# Altium project Enigma Rev A.PrjPCB (part 9 of 10)

## Sheet Power V12P0.SchDoc: 12.0 V Regulator
size Tabloid; Date: 8/14/2017; ApprovedBy: NA; CompanyName: Cospan Design LLC; DrawnBy: Dave McCoy; Engineer: Dave McCoy; DocumentNumber: 19; Revision: A; SheetNumber: 19; SheetTotal: 20; Client: Public; Project: Enigma; ProjectPrettyName: Enigma
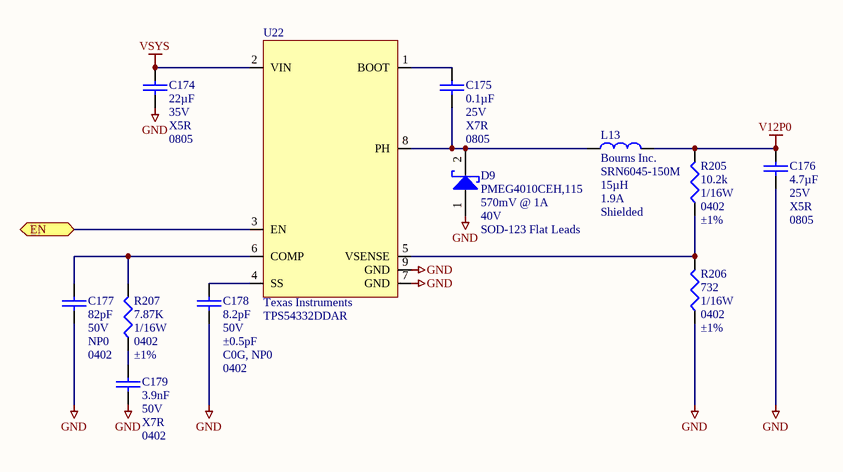
[diagram p17: Power V12P0.SchDoc]

### Parts
C174  Capacitance: 22µF  Voltage - Rated: 35V  Temperature Coefficient: X5R  Package / Case: 0805  [C_ERA-0805]  (hidden comment: C_0805_22µF_35V)
C175  Capacitance: 0.1µF  Voltage - Rated: 25V  Temperature Coefficient: X7R  Package / Case: 0805  [C_ERA-0805]  (hidden comment: 0.1uF)
C176  Voltage - Rated: 25V  Temperature Coefficient: X5R  Package / Case: 0805  [C_ERA-0805]  (hidden comment: 4.7µF)
C177  Voltage - Rated: 50V  Temperature Coefficient: NP0  Package / Case: 0402  [C_ERA-0402]  (hidden comment: 82pF)
C178  Voltage - Rated: 50V  Tolerance: ±0.5pF  Temperature Coefficient: C0G, NP0  Package / Case: 0402  [C_ERA-0402]  (hidden comment: 8.2pF)
C179  Capacitance: 3.9nF  Voltage - Rated: 50V  Temperature Coefficient: X7R  Package / Case: 0402  [C_0402]  (hidden comment: C_0402_3.9nF)
D9  Manufacturer Part Number: PMEG4010CEH,115  Voltage - Forward (Vf) (Max) @ If: 570mV @ 1A  Voltage - DC Reverse (Vr) (Max): 40V  Package / Case: SOD-123 Flat Leads  [D_SOD123F]  (hidden comment: D_SCHOTT_PMEG4010CEH)
L13  Manufacturer: Bourns Inc.  Manufacturer Part Number: SRN6045-150M  Inductance: 15µH  Current Rating: 1.9A  Shielding: Shielded  [SRN6045]  (hidden comment: L_SRN6045-150M)
R205  Resistance In Ohms: 10.2k  Power (Watts): 1/16W  Case: 0402  Tolerance: ±1%  [R_0402]  (hidden comment: R_0402_10.2k)
R206  Resistance In Ohms: 732  Power (Watts): 1/16W  Case: 0402  Tolerance: ±1%  [R_0402]  (hidden comment: R_0402_732)
R207  Resistance In Ohms: 7.87K  Power (Watts): 1/16W  Case: 0402  Tolerance: ±1%  [R_0402]  (hidden comment: R_0402_7.87K)
U22  Manufacturer: Texas Instruments  Manufacturer Part Number: TPS54332DDAR  [DDA0008H]  (hidden comment: U_TPS54332DDAR)

### Ports
EN

### Nets
GND: C174.1 C176.1 C177.1 C178.1 C179.1 D9.1(A) R206.2 U22.7(GND) U22.9(GND)
V12P0: C176.2 L13.1 R205.1
VSYS: C174.2 U22.2(VIN)
INT_REG_EN: U22.3(EN) ; port EN
NetC175_1: C175.1 D9.2(K) L13.2 U22.8(PH)
NetC175_2: C175.2 U22.1(BOOT)
NetC177_2: C177.2 R207.1 U22.6(COMP)
NetC178_2: C178.2 U22.4(SS)
NetC179_2: C179.2 R207.2
NetR205_2: R205.2 R206.1 U22.5(VSENSE)

### Library data of the parts
C174 = C_0805_22µF_35V: CAP CER 22UF 35V X5R 0805; Manufacturer: TDK Corporation; Manufacturer Part Number: C2012X5R1V226M125AC; Tolerance: ±20%; Supplier 1: Digi-Key; RoHS: RoHS Compliant; Category: Capacitors; Stock 1: 3681; Pricing 1: 1=1.14, 10=0.863, 100=0.6176, 500=0.47818, 1000=0.41176 (USD); Packaging: Cut Tape (CT); Mounting Type: Surface Mount, MLCC; Operating Temperature: -55°C ~ 85°C; Applications: General Purpose; Ratings: -; Size / Dimension: 0.079" L x 0.049" W (2.00mm x 1.25mm); Height - Seated (Max): -; Thickness (Max): 0.057" (1.45mm); Lead Spacing: -; Features: Low ESL; Lead Style: -; ComponentLink1URL: https://product.tdk.com/info/en/catalog/datasheets/mlcc_commercial_general_en.pdf; ComponentLink1Description: https://product.tdk.com/info/en/catalog/datasheets/mlcc_commercial_general_en.pdf; Supplier Part Number 1: 445-14428-1-ND; Part Status: Active; Failure Rate: -
C175 = C_0805_0.1uF_25V: CAP CER 1UF 50V X7R 0805; Manufacturer: AVX Corporation; Manufacturer Part Number: 08053C104KAT2A; Tolerance: ±10%; Supplier 1: Digi-Key; Supplier Part Number 1: 478-3755-1-ND; RoHS: RoHS Compliant; Category: Capacitors; Stock 1: 294368; Pricing: 1=0.22, 10=0.138, 100=0.0495, 250=0.03576, 500=0.0264, 1000=0.01788 (USD); Mounting Type: Surface Mount, MLCC; Operating Temperature: -55°C ~ 125°C; Applications: General Purpose; Ratings: -; Size / Dimension: 0.079" L x 0.049" W (2.01mm x 1.25mm); Height - Seated (Max): -; Thickness (Max): 0.037" (0.94mm); Lead Spacing: -; Features: -; Packaging: Cut Tape (CT); Lead Style: -; ComponentLink1URL: http://www.avx.com/docs/Catalogs/cx7r.pdf; ComponentLink1Description: http://www.avx.com/docs/Catalogs/cx7r.pdf
C176 = C_0805_4.7µF_25V: CAP CER 4.7UF 25V 10% X5R 0805; Manufacturer: Taiyo Yuden; Manufacturer Part Number: TMK212BJ475KG-T; Supplier 1: Digi-Key; RoHS: RoHS Compliant; Category: Capacitors; Stock 1: 38955; Pricing 1: 1=0.24, 10=0.2, 50=0.1126, 100=0.1, 250=0.075, 500=0.06626, 1000=0.05875 (USD); Tolerance: ±10%; Mounting Type: Surface Mount, MLCC; Operating Temperature: -55°C ~ 85°C; Applications: General Purpose; Ratings: -; Size / Dimension: 0.079" L x 0.049" W (2.00mm x 1.25mm); Height - Seated (Max): -; Thickness (Max): 0.053" (1.35mm); Lead Spacing: -; Features: -; Packaging: Cut Tape (CT); Lead Style: -; ComponentLink1URL: http://www.yuden.co.jp/productdata/catalog/en/mlcc01_e.pdf; ComponentLink1Description: http://www.yuden.co.jp/productdata/catalog/en/mlcc01_e.pdf; Supplier Part Number 1: 587-1782-1-ND; Capacitance: 4.7µF
C177 = C_0402_82PF_50V: CAP CER 82PF 50V 5% C0G 0402; Manufacturer: Murata Electronics North America; Manufacturer Part Number: GRM1555C1H820FA01D; Tolerance: ±1%; Description: CAP CER 82PF 50V C0G/NP0 0402; Supplier 1: Digi-Key; Supplier Part Number 1: 490-8228-1-ND; RoHS: RoHS Compliant; Category: Capacitors; Stock 1: 248442; Mounting Type: Surface Mount, MLCC; Operating Temperature: -55°C ~ 125°C; Applications: General Purpose; Ratings: -; Size / Dimension: 0.039" L x 0.020" W (1.00mm x 0.50mm); Lead Spacing: -; Features: -; Packaging: Cut Tape (CT); Lead Style: -; ComponentLink1URL: http://search.murata.co.jp/Ceramy/image/img/A01X/G101/ENG/GRM1555C1H820FA01-01.pdf; ComponentLink1Description: http://search.murata.co.jp/Ceramy/image/img/A01X/G101/ENG/GRM1555C1H820FA01-01.pdf; Capacitance: 82pF; Pricing 1: 1=0.1, 10=0.061, 100=0.0273, 500=0.01948, 1000=0.01531, 2500=0.01392, 5000=0.0128 (USD); Part Status: Active; Height - Seated (Max): -; Thickness (Max): 0.022" (0.55mm)
C178 = C_0402_8.2PF_50V: CAP CER 8.2PF 50V NP0 0402; Manufacturer: Yageo; Manufacturer Part Number: CC0402DRNPO9BN8R2; Description: CAP CER 8.2PF 50V C0G/NPO 0402; Supplier 1: Digi-Key; Supplier Part Number 1: 311-1012-1-ND; RoHS: RoHS Compliant; Category: Capacitors; Stock 1: 98543; Mounting Type: Surface Mount, MLCC; Operating Temperature: -55°C ~ 125°C; Applications: General Purpose; Ratings: -; Size / Dimension: 0.039" L x 0.020" W (1.00mm x 0.50mm); Height - Seated (Max): -; Thickness (Max): 0.022" (0.55mm); Lead Spacing: -; Features: -; Packaging: Cut Tape (CT); Lead Style: -; ComponentLink1URL: http://www.yageo.com/documents/recent/UPY-GP_NP0_16V-to-50V_16.pdf; ComponentLink1Description: http://www.yageo.com/documents/recent/UPY-GP_NP0_16V-to-50V_16.pdf; Capacitance: 8.2pF; Pricing 1: 1=0.1, 10=0.029, 100=0.0128, 500=0.00914, 1000=0.00718, 2500=0.00653, 5000=0.006 (USD); Part Status: Active; Failure Rate: -
C179 = C_0402_3.9nF: CAP CER 3900PF 50V X7R 0402; Manufacturer: Murata Electronics North America; Manufacturer Part Number: GRM155R71H392KA01D; Tolerance: ±10%; Supplier 1: Digi-Key; RoHS: RoHS Compliant; Category: Capacitors; Stock 1: 264193; Pricing 1: 1=0.1, 10=0.026, 100=0.0118, 500=0.00844, 1000=0.00662, 2500=0.00602, 5000=0.00554 (USD); Packaging: Cut Tape (CT); Part Status: Active; Operating Temperature: -55°C ~ 125°C; Features: -; Ratings: -; Applications: General Purpose; Mounting Type: Surface Mount, MLCC; Size / Dimension: 0.039" L x 0.020" W (1.00mm x 0.50mm); Height - Seated (Max): -; Thickness (Max): 0.022" (0.55mm); Lead Spacing: -; Lead Style: -; ComponentLink1URL: http://www.murata.com/~/media/webrenewal/support/library/catalog/products/capacitor/mlcc/c02e.ashx; ComponentLink1Description: http://www.murata.com/~/media/webrenewal/support/library/catalog/products/capacitor/mlcc/c02e.ashx; Supplier Part Number 1: 490-1307-1-ND
D9 = D_SCHOTT_PMEG4010CEH: SCHOTTKY RECT 40V 1A SOD123F; Manufacturer: Vishay Semiconductor Diodes Division; Speed: Fast Recovery =< 500ns, > 200mA (Io); Current - Reverse Leakage @ Vr: 500µA @ 40V; Capacitance @ Vr, F: 38pF @ 10V, 1MHz; Supplier 1: Digi-Key; RoHS: RoHS Compliant; Category: Discrete Semiconductor Products; Stock 1: 11879; Pricing 1: 1=0.46, 10=0.371, 25=0.3396, 100=0.2528, 250=0.22912, 500=0.1896, 1000=0.1422, 2500=0.13035 (USD); Packaging: Cut Tape (CT); Part Status: Active; Diode Type: Schottky; Current - Average Rectified (Io): 1A; Reverse Recovery Time (trr): -; Mounting Type: Surface Mount; Supplier Device Package: SMA; Operating Temperature - Junction: -55°C ~ 150°C; ComponentLink1URL: http://www.vishay.com/docs/94301/vs-mbra140trpbf.pdf; ComponentLink1Description: http://www.vishay.com/docs/94301/vs-mbra140trpbf.pdf; Supplier Part Number 1: VS-MBRA140TRPBFCT-ND
L13 = L_SRN6045-150M: FIXED IND 15UH 1.9A 95.8 MOHM; Vendor: Bourns; Type: DEV; Material - Core: Ferrite; Tolerance: ±20%; Current - Saturation: 2.3A; DC Resistance (DCR): 95.8 mOhm Max; Q @ Freq: 17 @ 2.52MHz; Frequency - Self Resonant: 13MHz; Frequency - Test: 100kHz; Datasheet URL: http://www.bourns.com/data/global/pdfs/SRN6045.pdf; Manufacturer_Part_Number: SRN6045-150M; Manufacturer_Name: Bourns; RefDes: RefDes; Value: Value; Supplier 1: Digi-Key; RoHS: RoHS Compliant; Category: Inductors, Coils, Chokes; Stock 1: 3119; Pricing 1: 1=0.43, 10=0.384, 25=0.36, 50=0.312, 100=0.288, 250=0.2736, 500=0.2496 (USD); Packaging: Cut Tape (CT); Part Status: Active; Ratings: -; Operating Temperature: -40°C ~ 125°C; Mounting Type: Surface Mount; Package / Case: Nonstandard; Size / Dimension: 0.236" L x 0.236" W (6.00mm x 6.00mm); Height - Seated (Max): 0.177" (4.50mm); ComponentLink1URL: http://www.bourns.com/docs/Product-Datasheets/SRN6045.pdf; ComponentLink1Description: http://www.bourns.com/docs/Product-Datasheets/SRN6045.pdf; Supplier Part Number 1: SRN6045-150MCT-ND
R205 = R_0402_10.2k: RES SMD 10.2K OHM 1% 1/16W 0402; Manufacturer: Stackpole Electronics Inc.; Manufacturer Part Number: RMCF0402FT10K2; Temperature Coefficient: ±100ppm/°C; Supplier 1: Digi-Key; RoHS: RoHS Compliant; Category: Resistors; Stock 1: 69477; Pricing 1: 1=0.1, 10=0.019, 50=0.0106, 100=0.0078, 250=0.00596, 500=0.00476, 1000=0.0035, 2500=0.00304, 5000=0.00251 (USD); Packaging: Cut Tape (CT); Resistance (Ohms): 10.2k; Composition: Thick Film; Features: Automotive AEC-Q200; Operating Temperature: -55°C ~ 155°C; Package / Case: 0402 (1005 Metric); Supplier Device Package: 0402; Size / Dimension: 0.039" L x 0.020" W (1.00mm x 0.50mm); Height: 0.016" (0.40mm); Number of Terminations: 2; ComponentLink1URL: http://www.seielect.com/Catalog/SEI-RMCF_RMCP.pdf; ComponentLink1Description: http://www.seielect.com/Catalog/SEI-RMCF_RMCP.pdf; Supplier Part Number 1: RMCF0402FT10K2CT-ND
R206 = R_0402_732: RES SMD 732 OHM 1% 1/16W 0402; Manufacturer: Yageo; Manufacturer Part Number: RC0402FR-07732RL; Temperature Coefficient: ±100ppm/°C; Supplier 1: Digi-Key; RoHS: RoHS Compliant; Category: Resistors; Stock 1: 21970; Pricing 1: 1=0.1, 10=0.014, 100=0.0055, 1000=0.00247, 2500=0.00214, 5000=0.00177 (USD); Packaging: Cut Tape (CT); Part Status: Active; Composition: Thick Film; Features: Moisture Resistant; Operating Temperature: -55°C ~ 155°C; Package / Case: 0402 (1005 Metric); Supplier Device Package: 0402; Size / Dimension: 0.039" L x 0.020" W (1.00mm x 0.50mm); Height - Seated (Max): 0.016" (0.40mm); Failure Rate: -; ComponentLink1URL: http://www.yageo.com/documents/recent/PYu-RC_Group_51_RoHS_L_7.pdf; ComponentLink1Description: http://www.yageo.com/documents/recent/PYu-RC_Group_51_RoHS_L_7.pdf; Supplier Part Number 1: YAG3225CT-ND
R207 = R_0402_7.87K: RES 7.87K OHM 1/16W 1% 0402 SMD; Manufacturer: Yageo; Manufacturer Part Number: RC0402FR-077K87L; Temperature Coefficient: ±100ppm/°C; Supplier 1: Digi-Key; Supplier Part Number 1: 311-7.87KLRCT-ND; RoHS: RoHS Compliant; Category: Resistors; Stock 1: 36940; Pricing: 10=0.014, 50=0.0104, 100=0.0079, 250=0.00584, 500=0.00432, 1000=0.00288 (USD); Resistance (Ohms): 7.87K; Composition: Thick Film; Features: -; Size / Dimension: 0.039" L x 0.020" W (1.00mm x 0.50mm); Height: 0.016" (0.40mm); Number of Terminations: 2; Packaging: Cut Tape (CT); Package / Case: 0402 (1005 Metric); ComponentLink1URL: http://www.yageo.com/documents/recent/PYu-RC0402_51_RoHS_L_6.pdf; ComponentLink1Description: http://www.yageo.com/documents/recent/PYu-RC0402_51_RoHS_L_6.pdf
U22 = U_TPS54332DDAR: IC REG BUCK ADJ 3.5A 8SOPWRPAD; Imax: 3.5; Function: Step-Down; Output Configuration: Positive; Output Type: Adjustable; Number of Outputs: 1; Voltage - Input (Min): 3.5V; Voltage - Input (Max): 28V; Voltage - Output (Min/Fixed): 0.8V; Voltage - Output (Max): 26.04V; Frequency - Switching: 1MHz; Synchronous Rectifier: No; Package: DDA0008H; Mktg_Package: DDA0008H; NSID: TPS54332DDAR; Vendor: Texas Instruments; RefDes: RefDes; Type: DEV; Value: Value; Supplier 1: Digi-Key; RoHS: RoHS Compliant; Category: Integrated Circuits (ICs); Stock 1: 8614; Pricing 1: 1=1.78, 10=1.597, 100=1.2812, 500=1.053, 1000=0.73125 (USD); Packaging: Cut Tape (CT); Part Status: Active; Topology: Buck; Current - Output: 3.5A; Operating Temperature: -40°C ~ 150°C (TJ); Mounting Type: Surface Mount; Package / Case: 8-PowerSOIC (0.154", 3.90mm Width); Supplier Device Package: 8-SO PowerPad; ComponentLink1URL: http://www.ti.com/lit/ds/symlink/tps54332.pdf; ComponentLink1Description: http://www.ti.com/lit/ds/symlink/tps54332.pdf; Supplier Part Number 1: 296-39420-1-ND

## Sheet Power Main Regulators.SchDoc: Main Regulator
size Tabloid; ApprovedBy: NA; CompanyName: Cospan Design LLC; DrawnBy: Dave McCoy; Engineer: Dave McCoy; DocumentNumber: 20; Revision: A; SheetNumber: 20; SheetTotal: 20; Client: Public; Project: Enigma; ProjectPrettyName: Enigma
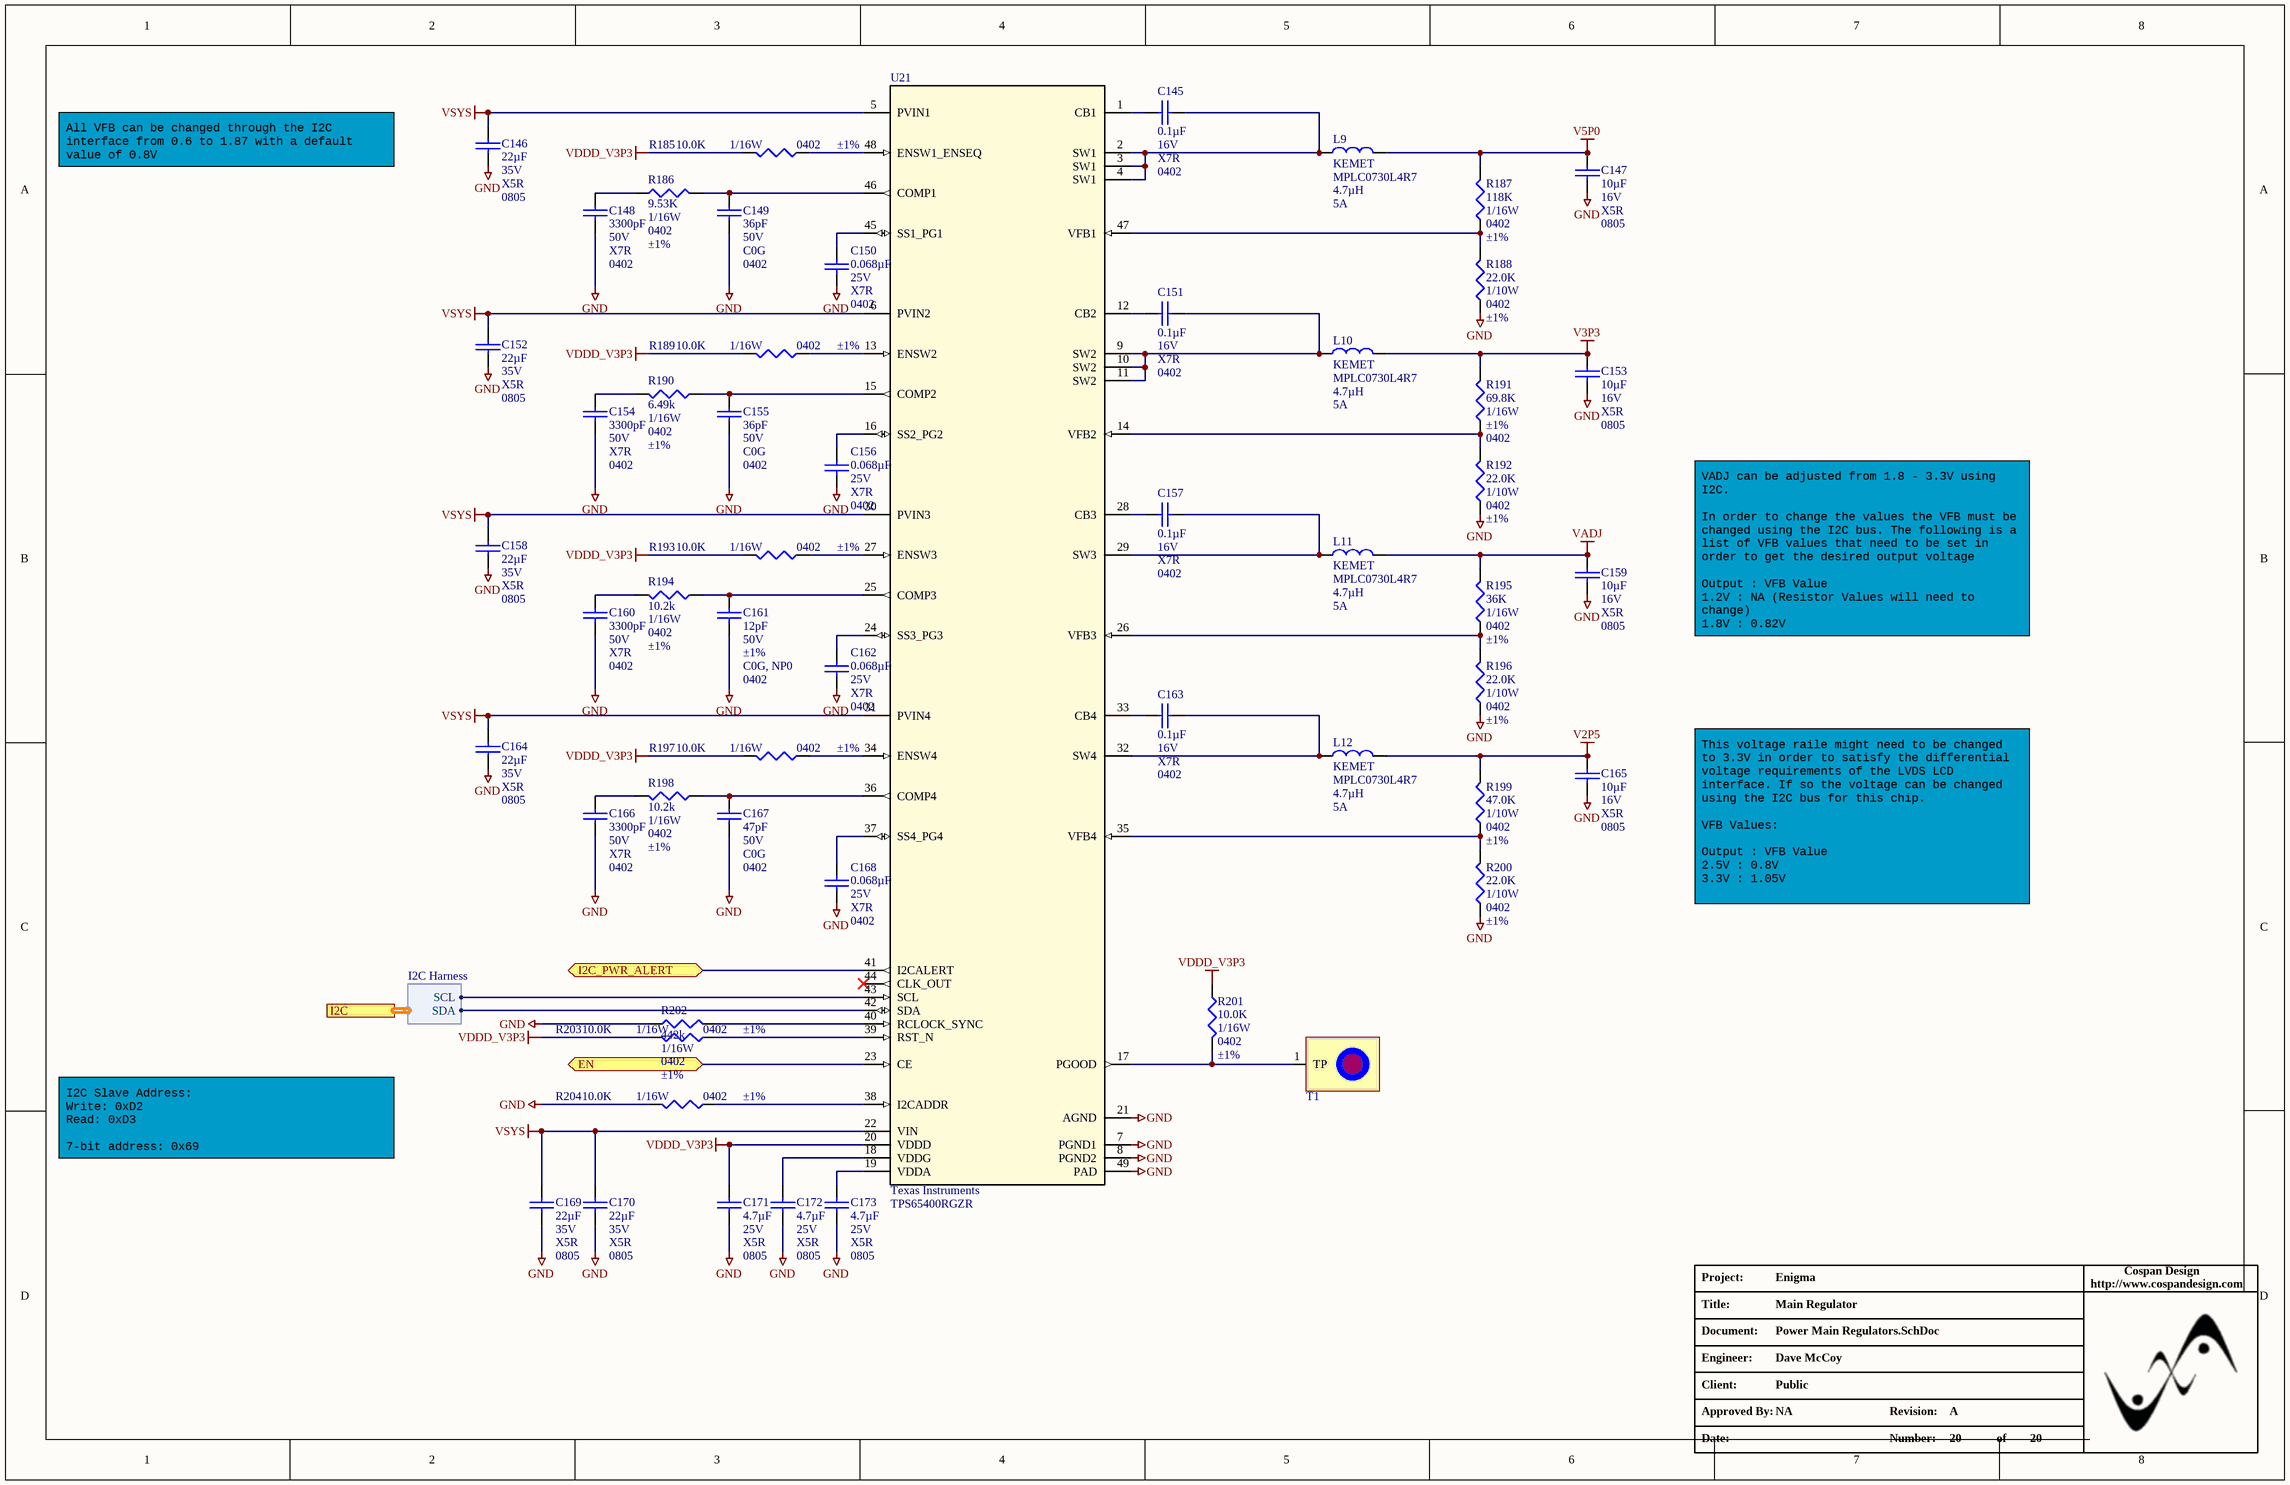
[diagram p18: Power Main Regulators.SchDoc]

### Parts
C145  Capacitance: 0.1µF  Voltage - Rated: 16V  Temperature Coefficient: X7R  Package / Case: 0402  [C_0402]  (hidden comment: 0.1uF)
C146  Capacitance: 22µF  Voltage - Rated: 35V  Temperature Coefficient: X5R  Package / Case: 0805  [C_ERA-0805]  (hidden comment: C_0805_22µF_35V)
C147  Voltage - Rated: 16V  Temperature Coefficient: X5R  Package / Case: 0805  [C_ERA-0805]  (hidden comment: 10µF)
C148  Capacitance: 3300pF  Voltage - Rated: 50V  Temperature Coefficient: X7R  Package / Case: 0402  [C_ERA-0402]  (hidden comment: C_0402_3.3nF_50V)
C149  Capacitance: 36pF  Voltage - Rated: 50V  Temperature Coefficient: C0G  Package / Case: 0402  [C_0402]  (hidden comment: C_0402_36pF)
C150  Capacitance: 0.068µF  Voltage - Rated: 25V  Temperature Coefficient: X7R  Package / Case: 0402  [C_0402]  (hidden comment: C_0402_68nF)
C151  Capacitance: 0.1µF  Voltage - Rated: 16V  Temperature Coefficient: X7R  Package / Case: 0402  [C_0402]  (hidden comment: 0.1uF)
C152  Capacitance: 22µF  Voltage - Rated: 35V  Temperature Coefficient: X5R  Package / Case: 0805  [C_ERA-0805]  (hidden comment: C_0805_22µF_35V)
C153  Voltage - Rated: 16V  Temperature Coefficient: X5R  Package / Case: 0805  [C_ERA-0805]  (hidden comment: 10µF)
C154  Capacitance: 3300pF  Voltage - Rated: 50V  Temperature Coefficient: X7R  Package / Case: 0402  [C_ERA-0402]  (hidden comment: C_0402_3.3nF_50V)
C155  Capacitance: 36pF  Voltage - Rated: 50V  Temperature Coefficient: C0G  Package / Case: 0402  [C_0402]  (hidden comment: C_0402_36pF)
C156  Capacitance: 0.068µF  Voltage - Rated: 25V  Temperature Coefficient: X7R  Package / Case: 0402  [C_0402]  (hidden comment: C_0402_68nF)
C157  Capacitance: 0.1µF  Voltage - Rated: 16V  Temperature Coefficient: X7R  Package / Case: 0402  [C_0402]  (hidden comment: 0.1uF)
C158  Capacitance: 22µF  Voltage - Rated: 35V  Temperature Coefficient: X5R  Package / Case: 0805  [C_ERA-0805]  (hidden comment: C_0805_22µF_35V)
C159  Voltage - Rated: 16V  Temperature Coefficient: X5R  Package / Case: 0805  [C_ERA-0805]  (hidden comment: 10µF)
C160  Capacitance: 3300pF  Voltage - Rated: 50V  Temperature Coefficient: X7R  Package / Case: 0402  [C_ERA-0402]  (hidden comment: C_0402_3.3nF_50V)
C161  Voltage - Rated: 50V  Tolerance: ±1%  Temperature Coefficient: C0G, NP0  Package / Case: 0402  [C_ERA-0402]  (hidden comment: 12pF)
C162  Capacitance: 0.068µF  Voltage - Rated: 25V  Temperature Coefficient: X7R  Package / Case: 0402  [C_0402]  (hidden comment: C_0402_68nF)
C163  Capacitance: 0.1µF  Voltage - Rated: 16V  Temperature Coefficient: X7R  Package / Case: 0402  [C_0402]  (hidden comment: 0.1uF)
C164  Capacitance: 22µF  Voltage - Rated: 35V  Temperature Coefficient: X5R  Package / Case: 0805  [C_ERA-0805]  (hidden comment: C_0805_22µF_35V)
C165  Voltage - Rated: 16V  Temperature Coefficient: X5R  Package / Case: 0805  [C_ERA-0805]  (hidden comment: 10µF)
C166  Capacitance: 3300pF  Voltage - Rated: 50V  Temperature Coefficient: X7R  Package / Case: 0402  [C_ERA-0402]  (hidden comment: C_0402_3.3nF_50V)
C167  Voltage - Rated: 50V  Temperature Coefficient: C0G  Package / Case: 0402  [C_0402]  (hidden comment: 47pF)
C168  Capacitance: 0.068µF  Voltage - Rated: 25V  Temperature Coefficient: X7R  Package / Case: 0402  [C_0402]  (hidden comment: C_0402_68nF)
C169  Capacitance: 22µF  Voltage - Rated: 35V  Temperature Coefficient: X5R  Package / Case: 0805  [C_ERA-0805]  (hidden comment: C_0805_22µF_35V)
C170  Capacitance: 22µF  Voltage - Rated: 35V  Temperature Coefficient: X5R  Package / Case: 0805  [C_ERA-0805]  (hidden comment: C_0805_22µF_35V)
C171  Voltage - Rated: 25V  Temperature Coefficient: X5R  Package / Case: 0805  [C_ERA-0805]  (hidden comment: 4.7µF)
C172  Voltage - Rated: 25V  Temperature Coefficient: X5R  Package / Case: 0805  [C_ERA-0805]  (hidden comment: 4.7µF)
C173  Voltage - Rated: 25V  Temperature Coefficient: X5R  Package / Case: 0805  [C_ERA-0805]  (hidden comment: 4.7µF)
L9  Manufacturer: KEMET  Manufacturer Part Number: MPLC0730L4R7  Inductance: 4.7µH  Max DC Current: 5A  [KEM_L9004_MPLC]  (hidden comment: L_MPLC0730L4R7)
L10  Manufacturer: KEMET  Manufacturer Part Number: MPLC0730L4R7  Inductance: 4.7µH  Max DC Current: 5A  [KEM_L9004_MPLC]  (hidden comment: L_MPLC0730L4R7)
L11  Manufacturer: KEMET  Manufacturer Part Number: MPLC0730L4R7  Inductance: 4.7µH  Max DC Current: 5A  [KEM_L9004_MPLC]  (hidden comment: L_MPLC0730L4R7)
L12  Manufacturer: KEMET  Manufacturer Part Number: MPLC0730L4R7  Inductance: 4.7µH  Max DC Current: 5A  [KEM_L9004_MPLC]  (hidden comment: L_MPLC0730L4R7)
R185  Resistance In Ohms: 10.0K  Power (Watts): 1/16W  Case: 0402  Tolerance: ±1%  [R_0402]  (hidden comment: R_0402_10.0K)
R186  Resistance In Ohms: 9.53K  Power (Watts): 1/16W  Case: 0402  Tolerance: ±1%  [R_0402]  (hidden comment: R_0402_9.53K)
R187  Resistance In Ohms: 118K  Power (Watts): 1/16W  Case: 0402  Tolerance: ±1%  [R_0402]  (hidden comment: R_0402_118K)
R188  Resistance In Ohms: 22.0K  Power (Watts): 1/10W  Case: 0402  Tolerance: ±1%  [R_0402]  (hidden comment: R_0402_22.0K)
R189  Resistance In Ohms: 10.0K  Power (Watts): 1/16W  Case: 0402  Tolerance: ±1%  [R_0402]  (hidden comment: R_0402_10.0K)
R190  Resistance In Ohms: 6.49k  Power (Watts): 1/16W  Case: 0402  Tolerance: ±1%  [R_0402]  (hidden comment: R_0402_6.49k)
R191  Resistance In Ohms: 69.8K  Power (Watts): 1/16W  Tolerance: ±1%  Case: 0402  [R_0402]  (hidden comment: R_0402_69.8K)
R192  Resistance In Ohms: 22.0K  Power (Watts): 1/10W  Case: 0402  Tolerance: ±1%  [R_0402]  (hidden comment: R_0402_22.0K)
R193  Resistance In Ohms: 10.0K  Power (Watts): 1/16W  Case: 0402  Tolerance: ±1%  [R_0402]  (hidden comment: R_0402_10.0K)
R194  Resistance In Ohms: 10.2k  Power (Watts): 1/16W  Case: 0402  Tolerance: ±1%  [R_0402]  (hidden comment: R_0402_10.2k)
R195  Resistance In Ohms: 36K  Power (Watts): 1/16W  Case: 0402  Tolerance: ±1%  [R_0402]  (hidden comment: R_0402_36.0K)
R196  Resistance In Ohms: 22.0K  Power (Watts): 1/10W  Case: 0402  Tolerance: ±1%  [R_0402]  (hidden comment: R_0402_22.0K)
R197  Resistance In Ohms: 10.0K  Power (Watts): 1/16W  Case: 0402  Tolerance: ±1%  [R_0402]  (hidden comment: R_0402_10.0K)
R198  Resistance In Ohms: 10.2k  Power (Watts): 1/16W  Case: 0402  Tolerance: ±1%  [R_0402]  (hidden comment: R_0402_10.2k)
R199  Resistance In Ohms: 47.0K  Power (Watts): 1/10W  Case: 0402  Tolerance: ±1%  [R_0402]  (hidden comment: R_0402_47.0K)
R200  Resistance In Ohms: 22.0K  Power (Watts): 1/10W  Case: 0402  Tolerance: ±1%  [R_0402]  (hidden comment: R_0402_22.0K)
R201  Resistance In Ohms: 10.0K  Power (Watts): 1/16W  Case: 0402  Tolerance: ±1%  [R_0402]  (hidden comment: R_0402_10.0K)
R202  Resistance In Ohms: 442k  Power (Watts): 1/16W  Case: 0402  Tolerance: ±1%  [R_0402]  (hidden comment: R_0402_442k)
R203  Resistance In Ohms: 10.0K  Power (Watts): 1/16W  Case: 0402  Tolerance: ±1%  [R_0402]  (hidden comment: R_0402_10.0K)
R204  Resistance In Ohms: 10.0K  Power (Watts): 1/16W  Case: 0402  Tolerance: ±1%  [R_0402]  (hidden comment: R_0402_10.0K)
T1  TEST_POINT_SMALL  [TestPointSmall]  (value not drawn)  (no BOM)
U21  Manufacturer: Texas Instruments  Manufacturer Part Number: TPS65400RGZR  [RGZ0048B]  (hidden comment: U_TPS65400RGZR)

### Ports
EN, I2C (harness I2C Harness), I2C_PWR_ALERT

### Harnesses
I2C Harness: SCL, SDA

### Nets
GND: C146.1 C147.1 C148.1 C149.1 C150.1 C152.1 C153.1 C154.1 C155.1 C156.1 C158.1 C159.1 C160.1 C161.1 C162.1 C164.1 C165.1 C166.1 C167.1 C168.1 C169.1 C170.1 C171.1 C172.1 C173.1 R188.2 R192.2 R196.2 R200.2 R202.2 R204.1 U21.7(PGND1) U21.8(PGND2) U21.21(AGND) U21.49(PAD)
V2P5: C165.2 L12.1 R199.1
V3P3: C153.2 L10.1 R191.1
V5P0: C147.2 L9.1 R187.1
VADJ: C159.2 L11.1 R195.1
VDDD_V3P3: C171.2 R185.1 R189.1 R193.1 R197.1 R201.2 R203.1 U21.20(VDDD)
VSYS: C146.2 C152.2 C158.2 C164.2 C169.2 C170.2 U21.5(PVIN1) U21.6(PVIN2) U21.22(VIN) U21.30(PVIN3) U21.31(PVIN4)
INT_REG_EN: U21.23(CE) ; port EN
TOUCH_SCL: U21.43(SCL) ; port I2C.SCL
TOUCH_SDA: U21.42(SDA) ; port I2C.SDA
NetC145_1: C145.1 L9.2 U21.2(SW1) U21.3(SW1) U21.4(SW1)
NetC145_2: C145.2 U21.1(CB1)
NetC148_2: C148.2 R186.2
NetC149_2: C149.2 R186.1 U21.46(COMP1)
NetC150_2: C150.2 U21.45(SS1_PG1)
NetC151_1: C151.1 L10.2 U21.9(SW2) U21.10(SW2) U21.11(SW2)
NetC151_2: C151.2 U21.12(CB2)
NetC154_2: C154.2 R190.1
NetC155_2: C155.2 R190.2 U21.15(COMP2)
NetC156_2: C156.2 U21.16(SS2_PG2)
NetC157_1: C157.1 L11.2 U21.29(SW3)
NetC157_2: C157.2 U21.28(CB3)
NetC160_2: C160.2 R194.1
NetC161_2: C161.2 R194.2 U21.25(COMP3)
NetC162_2: C162.2 U21.24(SS3_PG3)
NetC163_1: C163.1 L12.2 U21.32(SW4)
NetC163_2: C163.2 U21.33(CB4)
NetC166_2: C166.2 R198.1
NetC167_2: C167.2 R198.2 U21.36(COMP4)
NetC168_2: C168.2 U21.37(SS4_PG4)
NetC172_2: C172.2 U21.18(VDDG)
NetC173_2: C173.2 U21.19(VDDA)
NetR185_2: R185.2 U21.48(ENSW1_ENSEQ)
NetR187_2: R187.2 R188.1 U21.47(VFB1)
NetR189_2: R189.2 U21.13(ENSW2)
NetR191_2: R191.2 R192.1 U21.14(VFB2)
NetR193_2: R193.2 U21.27(ENSW3)
NetR195_2: R195.2 R196.1 U21.26(VFB3)
NetR197_2: R197.2 U21.34(ENSW4)
NetR199_2: R199.2 R200.1 U21.35(VFB4)
NetR201_1: R201.1 T1.1(TP) U21.17(PGOOD)
NetR202_1: R202.1 U21.40(RCLOCK_SYNC)
NetR203_2: R203.2 U21.39(RST_N)
NetR204_2: R204.2 U21.38(I2CADDR)
NetT2_1: U21.41(I2CALERT) ; port I2C_PWR_ALERT

Not connected (* = marked no-connect by the designer): U21 44(CLK_OUT)*

### Notes on the sheet
- All VFB can be changed through the I2C interface from 0.6 to 1.87 with a default value of 0.8V
- VADJ can be adjusted from 1.8 - 3.3V using I2C.
  In order to change the values the VFB must be changed using the I2C bus. The following is a list of VFB values that need to be set in order to get the desired output voltage
  Output	: VFB Value
  1.2V	: NA (Resistor Values will need to change)
  1.8V	: 0.82V
  2.5V	: 1.14V
  3.3V	: 1.51V
- This voltage raile might need to be changed to 3.3V in order to satisfy the differential voltage requirements of the LVDS LCD interface. If so the voltage can be changed using the I2C bus for this chip.
  VFB Values:
  Output	: VFB Value
  2.5V	: 0.8V
  3.3V	: 1.05V
- I2C Slave Address:
  Write: 0xD2
  Read: 0xD3
  7-bit address: 0x69
- Project:
- http://www.cospandesign.com
- Cospan Design
- Document:
- Engineer:
- Title:
- Client:
- Approved By:
- Revision:
- Date:
- Number:
- of

### Library data of the parts
C145 C151 C157 C163 = C_0402_0.1UF_16V: as C17 on sheet Battery Manager; Supplier 1: Digi-Key; RoHS: RoHS Compliant; Category: Capacitors; Stock 1: 18103134; Pricing 1: 1=0.1, 10=0.014, 100=0.0062, 500=0.00442, 1000=0.00348, 2500=0.00316, 5000=0.00291 (USD); Packaging: Cut Tape (CT); Part Status: Active; Operating Temperature: -55°C ~ 125°C; Features: -; Ratings: -; Applications: General Purpose; Mounting Type: Surface Mount, MLCC; Size / Dimension: 0.039" L x 0.020" W (1.00mm x 0.50mm); Height - Seated (Max): -; Thickness (Max): 0.022" (0.55mm); Lead Spacing: -; ComponentLink1URL: http://www.murata.com/~/media/webrenewal/support/library/catalog/products/capacitor/mlcc/c02e.ashx?la=en-us; ComponentLink1Description: http://www.murata.com/~/media/webrenewal/support/library/catalog/products/capacitor/mlcc/c02e.ashx?la=en-us; Supplier Part Number 1: 490-6328-1-ND
C146 C152 C158 C164 C169 C170 = C_0805_22µF_35V: as C174 on sheet Power V12P0; Supplier 1: Digi-Key; RoHS: RoHS Compliant; Category: Capacitors; Stock 1: 3681; Pricing 1: 1=1.14, 10=0.863, 100=0.6176, 500=0.47818, 1000=0.41176 (USD); Packaging: Cut Tape (CT); Mounting Type: Surface Mount, MLCC; Operating Temperature: -55°C ~ 85°C; Applications: General Purpose; Ratings: -; Size / Dimension: 0.079" L x 0.049" W (2.00mm x 1.25mm); Height - Seated (Max): -; Thickness (Max): 0.057" (1.45mm); Lead Spacing: -; Features: Low ESL; Lead Style: -; ComponentLink1URL: https://product.tdk.com/info/en/catalog/datasheets/mlcc_commercial_general_en.pdf; ComponentLink1Description: https://product.tdk.com/info/en/catalog/datasheets/mlcc_commercial_general_en.pdf; Supplier Part Number 1: 445-14428-1-ND; Part Status: Active; Failure Rate: -
C147 C153 C159 C165 = C_0805_10UF_16V: CAP CER 10uF 16V X5R 20% 0805; Manufacturer: Taiyo Yuden; Manufacturer Part Number: EMK212BJ106KG-T; Description: CAP CER 10UF 16V X5R 0805; Tolerance: ±10%; Supplier 1: Digi-Key; Supplier Part Number 1: 587-1295-1-ND; Category: Capacitors; Stock 1: 2052124; Capacitance: 10µF; RoHS: RoHS Compliant; Pricing 1: 1=0.2, 10=0.139, 100=0.0656, 500=0.04596, 1000=0.03805 (USD); Packaging: Cut Tape (CT); Part Status: Active; Operating Temperature: -55°C ~ 85°C; Features: -; Ratings: -; Applications: General Purpose; Mounting Type: Surface Mount, MLCC; Size / Dimension: 0.079" L x 0.049" W (2.00mm x 1.25mm); Height - Seated (Max): -; Thickness (Max): 0.053" (1.35mm); Lead Spacing: -; Lead Style: -; ComponentLink1URL: http://www.yuden.co.jp/productdata/catalog/en/mlcc01_e.pdf; ComponentLink1Description: http://www.yuden.co.jp/productdata/catalog/en/mlcc01_e.pdf
C148 C154 C160 C166 = C_0402_3.3nF_50V: Manufacturer: Murata Electronics North America; Manufacturer Part Number: GRM155R71H332KA01D; Tolerance: ±10%; Description: CAP CER 3300PF 50V X7R 0402; Supplier 1: Digi-Key; Supplier Part Number 1: 490-3248-1-ND; RoHS: RoHS Compliant; Category: Capacitors; Stock 1: 717319; Mounting Type: Surface Mount, MLCC; Operating Temperature: -55°C ~ 125°C; Applications: General Purpose; Size / Dimension: 0.039" L x 0.020" W (1.00mm x 0.50mm); Thickness (Max): 0.022" (0.55mm); Packaging: Cut Tape (CT); ComponentLink1URL: http://www.murata.com/~/media/webrenewal/support/library/catalog/products/capacitor/mlcc/c02e.ashx?la=en-us; ComponentLink1Description: http://www.murata.com/~/media/webrenewal/support/library/catalog/products/capacitor/mlcc/c02e.ashx?la=en-us; Pricing 1: 1=0.1, 10=0.013, 100=0.0059, 500=0.0042, 1000=0.0033, 2500=0.003, 5000=0.00276 (USD); Part Status: Active; Features: -; Ratings: -; Height - Seated (Max): -; Lead Spacing: -; Lead Style: -
C149 C155 = C_0402_36pF: CAP CER 36PF 50V NP0 0402; Manufacturer: Samsung Electro-Mechanics America, Inc.; Manufacturer Part Number: CL05C360JB5NNNC; Tolerance: ±5%; Supplier 1: Digi-Key; RoHS: RoHS Compliant; Category: Capacitors; Stock 1: 24626; Pricing 1: 1=0.1, 10=0.03, 25=0.0208, 50=0.016, 100=0.0135, 500=0.00948, 1000=0.00738, 5000=0.00615 (USD); Packaging: Cut Tape (CT); Mounting Type: Surface Mount, MLCC; Operating Temperature: -55°C ~ 125°C; Applications: General Purpose; Ratings: -; Size / Dimension: 0.039" L x 0.020" W (1.00mm x 0.50mm); Height - Seated (Max): -; Thickness (Max): 0.022" (0.55mm); Lead Spacing: -; Features: -; Lead Style: -; ComponentLink1URL: http://www.samsungsem.com/kr/support/product-search/mlcc/CL05C360JB5NNNC.jsp; ComponentLink1Description: http://www.samsungsem.com/kr/support/product-search/mlcc/CL05C360JB5NNNC.jsp; Supplier Part Number 1: 1276-1686-1-ND
C150 C156 C162 C168 = C_0402_68nF: CAP CER 0.068UF 25V X7R 0402; Manufacturer: Murata Electronics North America; Manufacturer Part Number: GRM155R71E683KE14D; Tolerance: ±10%; Supplier 1: Digi-Key; RoHS: RoHS Compliant; Category: Capacitors; Stock 1: 7620; Pricing 1: 1=0.1, 10=0.031, 100=0.0136, 500=0.00974, 1000=0.00765, 2500=0.00696, 5000=0.0064 (USD); Packaging: Cut Tape (CT); Part Status: Active; Operating Temperature: -55°C ~ 125°C; Features: -; Ratings: -; Applications: General Purpose; Failure Rate: -; Mounting Type: Surface Mount, MLCC; Size / Dimension: 0.039" L x 0.020" W (1.00mm x 0.50mm); Height - Seated (Max): -; Thickness (Max): 0.022" (0.55mm); Lead Spacing: -; Lead Style: -; ComponentLink1URL: http://search.murata.co.jp/Ceramy/image/img/A01X/G101/ENG/GRM155R71E683KE14-01.pdf; ComponentLink1Description: http://search.murata.co.jp/Ceramy/image/img/A01X/G101/ENG/GRM155R71E683KE14-01.pdf; Supplier Part Number 1: 490-14604-1-ND
C161 = C_0402_12PF_50V: CAP CER 12PF 50V 5% C0G 0402; Manufacturer: Murata Electronics North America; Manufacturer Part Number: GRM1555C1H120FA01D; Description: CAP CER 12PF 50V C0G/NP0 0402; Supplier 1: Digi-Key; Supplier Part Number 1: 490-6196-1-ND; RoHS: RoHS Compliant; Category: Capacitors; Stock 1: 386052; Mounting Type: Surface Mount, MLCC; Operating Temperature: -55°C ~ 125°C; Applications: General Purpose; Ratings: -; Size / Dimension: 0.039" L x 0.020" W (1.00mm x 0.50mm); Lead Spacing: -; Features: -; Packaging: Cut Tape (CT); Lead Style: -; ComponentLink1URL: http://search.murata.co.jp/Ceramy/image/img/A01X/G101/ENG/GRM1555C1H120FA01-01.pdf; ComponentLink1Description: http://search.murata.co.jp/Ceramy/image/img/A01X/G101/ENG/GRM1555C1H120FA01-01.pdf; Capacitance: 12pF; Pricing 1: 1=0.1, 10=0.05, 100=0.0223, 500=0.01594, 1000=0.01252, 2500=0.01138, 5000=0.01047 (USD); Part Status: Active; Height - Seated (Max): -; Thickness (Max): 0.022" (0.55mm)
C167 = C_0402_47p_50V: CAP CER 47PF 50V 5% C0G 0402; Manufacturer: Murata Electronics North America; Manufacturer Part Number: GRM1555C1H470JA01D; Supplier 1: Digi-Key; RoHS: RoHS Compliant; Category: Capacitors; Stock 1: 682755; Pricing 1: 1=0.1, 10=0.013, 50=0.007, 100=0.0059, 250=0.00488, 500=0.00416, 1000=0.00324, 5000=0.0027 (USD); Packaging: Cut Tape (CT); Tolerance: ±5%; Mounting Type: Surface Mount, MLCC; Operating Temperature: -55°C ~ 125°C; Applications: General Purpose; Ratings: -; Size / Dimension: 0.039" L x 0.020" W (1.00mm x 0.50mm); Height - Seated (Max): -; Thickness (Max): 0.022" (0.55mm); Lead Spacing: -; Features: -; Lead Style: -; ComponentLink1URL: http://www.murata.com/~/media/webrenewal/support/library/catalog/products/capacitor/mlcc/c02e.ashx; ComponentLink1Description: http://www.murata.com/~/media/webrenewal/support/library/catalog/products/capacitor/mlcc/c02e.ashx; Supplier Part Number 1: 490-5942-1-ND; Capacitance: 47pF
C171-C173 = C_0805_4.7µF_25V: as C176 on sheet Power V12P0; Supplier 1: Digi-Key; RoHS: RoHS Compliant; Category: Capacitors; Stock 1: 38955; Pricing 1: 1=0.24, 10=0.2, 50=0.1126, 100=0.1, 250=0.075, 500=0.06626, 1000=0.05875 (USD); Tolerance: ±10%; Mounting Type: Surface Mount, MLCC; Operating Temperature: -55°C ~ 85°C; Applications: General Purpose; Ratings: -; Size / Dimension: 0.079" L x 0.049" W (2.00mm x 1.25mm); Height - Seated (Max): -; Thickness (Max): 0.053" (1.35mm); Lead Spacing: -; Features: -; Packaging: Cut Tape (CT); Lead Style: -; ComponentLink1URL: http://www.yuden.co.jp/productdata/catalog/en/mlcc01_e.pdf; ComponentLink1Description: http://www.yuden.co.jp/productdata/catalog/en/mlcc01_e.pdf; Supplier Part Number 1: 587-1782-1-ND; Capacitance: 4.7µF
L9-L12 = L_MPLC0730L4R7: FIXED IND 4.7UH 5A 41 MOHM SMD; Type: Wirewound; Tolerance: ±20%; Shielding: Shielded; DC Resistance (DCR): 41 mOhm Max; Supplier 1: Digi-Key; RoHS: RoHS Compliant; Category: Inductors, Coils, Chokes; Stock 1: 3443; Pricing 1: 1=0.9, 10=0.837, 25=0.7728, 50=0.644, 100=0.6054, 250=0.54096, 500=0.46368 (USD); Packaging: Cut Tape (CT); Part Status: Active; Material - Core: -; Q @ Freq: -; Ratings: -; Operating Temperature: -20°C ~ 120°C; Mounting Type: Surface Mount; Package / Case: 2-SMD, J-Lead; Supplier Device Package: -; Size / Dimension: 0.303" L x 0.264" W (7.70mm x 6.70mm); Height - Seated (Max): 0.118" (3.00mm); ComponentLink1URL: https://search.kemet.com/component-edge/download/datasheet/MPLC0730L4R7.pdf; ComponentLink1Description: https://search.kemet.com/component-edge/download/datasheet/MPLC0730L4R7.pdf; Supplier Part Number 1: 399-10992-1-ND
R185 R189 R193 R197 R201 R203 R204 = R_0402_10.0K: as R24 on sheet Battery Manager; Supplier 1: Digi-Key; Supplier Part Number 1: RMCF0402FT10K0CT-ND; RoHS: RoHS Compliant; Category: Resistors; Stock 1: 234525; Pricing: 1=0.04, 10=0.025, 50=0.0138, 100=0.0105, 250=0.0078, 500=0.00576, 1000=0.00384, 2500=0.00324, 5000=0.0027 (USD); Composition: Thick Film; Features: -; Package / Case: 0402 (1005 Metric); Size / Dimension: 0.039" L x 0.020" W (1.00mm x 0.50mm); Height: 0.016" (0.40mm); Number of Terminations: 2; Packaging: Cut Tape (CT); ComponentLink1URL: http://www.seielect.com/Catalog/SEI-RMCF_RMCP.pdf; ComponentLink1Description: http://www.seielect.com/Catalog/SEI-RMCF_RMCP.pdf
R186 = R_0402_9.53K: RES SMD 9.53K OHM 1% 1/16W 0402; Manufacturer: Yageo; Manufacturer Part Number: RC0402FR-079K53L; Temperature Coefficient: ±100ppm/°C; Supplier 1: Digi-Key; RoHS: RoHS Compliant; Category: Resistors; Stock 1: 234095; Pricing 1: 1=0.1, 10=0.013, 25=0.0096, 100=0.0054, 250=0.00412, 500=0.00328, 1000=0.00242, 2500=0.0021, 5000=0.00173 (USD); Packaging: Cut Tape (CT); Part Status: Active; Resistance (Ohms): 9.53k; Composition: Thick Film; Features: Moisture Resistant; Operating Temperature: -55°C ~ 155°C; Package / Case: 0402 (1005 Metric); Supplier Device Package: 0402; Size / Dimension: 0.039" L x 0.020" W (1.00mm x 0.50mm); Height: 0.016" (0.40mm); Number of Terminations: 2; ComponentLink1URL: http://www.yageo.com/documents/recent/PYu-RC_Group_51_RoHS_L_04.pdf; ComponentLink1Description: http://www.yageo.com/documents/recent/PYu-RC_Group_51_RoHS_L_04.pdf; Supplier Part Number 1: 311-9.53KLRCT-ND
R187 = R_0402_118K: RES SMD 118K OHM 1% 1/16W 0402; Manufacturer: Stackpole Electronics Inc; Manufacturer Part Number: RMCF0402FT118K; Temperature Coefficient: ±100ppm/°C; Supplier 1: Digi-Key; RoHS: RoHS Compliant; Category: Resistors; Stock 1: 43108; Pricing 1: 1=0.1, 10=0.025, 50=0.0138, 100=0.0105, 250=0.0078, 500=0.00576, 1000=0.00384, 2500=0.00324, 5000=0.0027 (USD); Packaging: Cut Tape (CT); Resistance (Ohms): 118k; Composition: Thick Film; Features: Automotive AEC-Q200; Operating Temperature: -55°C ~ 155°C; Package / Case: 0402 (1005 Metric); Supplier Device Package: 0402; Size / Dimension: 0.039" L x 0.020" W (1.00mm x 0.50mm); Height: 0.016" (0.40mm); Number of Terminations: 2; ComponentLink1URL: http://www.seielect.com/Catalog/SEI-RMCF_RMCP.pdf; ComponentLink1Description: http://www.seielect.com/Catalog/SEI-RMCF_RMCP.pdf; Supplier Part Number 1: RMCF0402FT118KCT-ND
R188 R192 R196 R200 = R_0402_22.0K: RES 22.0K OHM 1/10W 1% 0402 SMD; Manufacturer: Vishay Dale; Manufacturer Part Number: CRCW040222K0FKED; Resistance (Ohms): 22k; Temperature Coefficient: ±100ppm/°C; Supplier 1: Digi-Key; Supplier Part Number 1: 541-22.0KLCT-ND; RoHS: RoHS Compliant; Category: Resistors; Stock 1: 15892; Pricing: 10=0.083, 50=0.0444, 200=0.0255, 1000=0.0174 (USD); Composition: Thick Film; Features: -; Package / Case: 0402 (1005 Metric); Size / Dimension: 0.039" L x 0.020" W (1.00mm x 0.50mm); Height: 0.016" (0.40mm); Number of Terminations: 2; Packaging: Cut Tape (CT); ComponentLink1URL: http://www.vishay.com/doc?20035; ComponentLink1Description: http://www.vishay.com/doc?20035
R190 = R_0402_6.49k: RES SMD 6.49K OHM 1% 1/16W 0402; Manufacturer: Samsung Electro-Mechanics America, Inc.; Manufacturer Part Number: RC1005F6491CS; Temperature Coefficient: ±100ppm/°C; Supplier 1: Digi-Key; RoHS: RoHS Compliant; Category: Resistors; Stock 1: 45311; Pricing 1: 1=0.1, 10=0.013, 25=0.0096, 50=0.0074, 100=0.0054, 250=0.00412, 500=0.00328, 1000=0.00242, 2500=0.0021 (USD); Packaging: Cut Tape (CT); Resistance (Ohms): 6.49k; Composition: Thick Film; Features: -; Operating Temperature: -55°C ~ 155°C; Package / Case: 0402 (1005 Metric); Supplier Device Package: 0402 (1005 Metric); Size / Dimension: 0.039" L x 0.020" W (1.00mm x 0.50mm); Height: 0.016" (0.40mm); Number of Terminations: 2; ComponentLink1URL: http://media.digikey.com/pdf/Data%20Sheets/Samsung%20PDFs/RC_Series_ds.pdf; ComponentLink1Description: http://media.digikey.com/pdf/Data%20Sheets/Samsung%20PDFs/RC_Series_ds.pdf; Supplier Part Number 1: 1276-4096-1-ND
R191 = R_0402_69.8K: RES 69.8K OHM 1/16W 1% 0402 SMD; Manufacturer: Yageo; Manufacturer Part Number: RC0402FR-0769K8L; Temperature Coefficient: ±100ppm/°C; Description: RES SMD 69.8K OHM 1% 1/16W 0402; Supplier 1: Digi-Key; Supplier Part Number 1: YAG3216CT-ND; RoHS: RoHS Compliant; Category: Resistors; Stock 1: 160383; Composition: Thick Film; Features: Moisture Resistant; Package / Case: 0402 (1005 Metric); Size / Dimension: 0.039" L x 0.020" W (1.00mm x 0.50mm); Packaging: Cut Tape (CT); ComponentLink1URL: http://www.yageo.com/documents/recent/PYu-RC_Group_51_RoHS_L_7.pdf; ComponentLink1Description: http://www.yageo.com/documents/recent/PYu-RC_Group_51_RoHS_L_7.pdf; Pricing 1: 1=0.1, 10=0.014, 100=0.0055, 1000=0.00247, 2500=0.00214, 5000=0.00177 (USD); Part Status: Active; Operating Temperature: -55°C ~ 155°C; Supplier Device Package: 0402; Height - Seated (Max): 0.016" (0.40mm); Failure Rate: -
R194 R198 = R_0402_10.2k: as R205 on sheet Power V12P0; Supplier 1: Digi-Key; RoHS: RoHS Compliant; Category: Resistors; Stock 1: 69477; Pricing 1: 1=0.1, 10=0.019, 50=0.0106, 100=0.0078, 250=0.00596, 500=0.00476, 1000=0.0035, 2500=0.00304, 5000=0.00251 (USD); Packaging: Cut Tape (CT); Resistance (Ohms): 10.2k; Composition: Thick Film; Features: Automotive AEC-Q200; Operating Temperature: -55°C ~ 155°C; Package / Case: 0402 (1005 Metric); Supplier Device Package: 0402; Size / Dimension: 0.039" L x 0.020" W (1.00mm x 0.50mm); Height: 0.016" (0.40mm); Number of Terminations: 2; ComponentLink1URL: http://www.seielect.com/Catalog/SEI-RMCF_RMCP.pdf; ComponentLink1Description: http://www.seielect.com/Catalog/SEI-RMCF_RMCP.pdf; Supplier Part Number 1: RMCF0402FT10K2CT-ND
R195 = R_0402_36.0K: RES 36.0K OHM 1/10W 1% 0402 SMD; Manufacturer: Panasonic - ECG; Manufacturer Part Number: ERJ-2RKF3602X; Temperature Coefficient: ±100ppm/°C; Supplier 1: Digi-Key; Supplier Part Number 1: P36.0KLCT-ND; RoHS: RoHS Compliant; Category: Resistors; Stock 1: 39656; Pricing: 1=0.06, 50=0.0242, 100=0.0184, 250=0.01364, 500=0.01008, 1000=0.00672, 5000=0.00473 (USD); Resistance (Ohms): 36K; Composition: Thick Film; Features: -; Size / Dimension: 0.039" L x 0.020" W (1.00mm x 0.50mm); Height: 0.016" (0.40mm); Number of Terminations: 2; Packaging: Cut Tape (CT); Package / Case: 0402 (1005 Metric); ComponentLink1URL: http://industrial.panasonic.com/www-cgi/jvcr13pz.cgi?E+PZ+3+AOA0002+ERJ2RKF3602X+7+WW; ComponentLink1Description: http://industrial.panasonic.com/www-cgi/jvcr13pz.cgi?E+PZ+3+AOA0002+ERJ2RKF3602X+7+WW
R199 = R_0402_47.0K: RES 47.0K OHM 1/10W 1% 0402 SMD; Manufacturer: Panasonic - ECG; Manufacturer Part Number: ERJ-2RKF4702X; Resistance (Ohms): 47K; Temperature Coefficient: ±100ppm/°C; Supplier 1: Digi-Key; Supplier Part Number 1: P47.0KLCT-ND; RoHS: RoHS Compliant; Category: Resistors; Stock 1: 503654; Pricing: 1=0.06, 50=0.0242, 100=0.0184, 250=0.01364, 500=0.01008, 1000=0.00672, 5000=0.00473 (USD); Composition: Thick Film; Features: -; Size / Dimension: 0.039" L x 0.020" W (1.00mm x 0.50mm); Height: 0.014" (0.35mm); Number of Terminations: 2; Packaging: Cut Tape (CT); Package / Case: 0402 (1005 Metric); ComponentLink1URL: http://industrial.panasonic.com/www-cgi/jvcr13pz.cgi?E+PZ+3+AOA0002+ERJ2RKF4702X+7+WW; ComponentLink1Description: http://industrial.panasonic.com/www-cgi/jvcr13pz.cgi?E+PZ+3+AOA0002+ERJ2RKF4702X+7+WW
R202 = R_0402_442k: RES SMD 442K OHM 1% 1/16W 0402; Manufacturer: Yageo; Manufacturer Part Number: RC0402FR-07442KL; Temperature Coefficient: ±100ppm/°C; Supplier 1: Digi-Key; Stock 1: 113995; Pricing 1: 1=0.1, 10=0.014, 100=0.0056, 1000=0.00253, 2500=0.0022, 5000=0.00181 (USD); Packaging: Cut Tape (CT); Composition: Thick Film; ComponentLink1URL: http://www.yageo.com/documents/recent/PYu-RC_Group_51_RoHS_L_7.pdf; ComponentLink1Description: http://www.yageo.com/documents/recent/PYu-RC_Group_51_RoHS_L_7.pdf; Supplier Part Number 1: 311-442KLRCT-ND; RoHS: RoHS Compliant; Category: Resistors; Part Status: Active; Features: Moisture Resistant; Operating Temperature: -55°C ~ 155°C; Package / Case: 0402 (1005 Metric); Supplier Device Package: 0402; Size / Dimension: 0.039" L x 0.020" W (1.00mm x 0.50mm); Height - Seated (Max): 0.016" (0.40mm); Failure Rate: -
T1 = TEST_POINT_SMALL: OSCILLOSCOPE TEST POINT
U21 = U_TPS65400RGZR: IC REG BUCK ADJ 4A/2A QD 48VQFN; Function: Step-Down; Output Configuration: Positive; Output Type: Adjustable; Number of Outputs: 4; Voltage - Input (Min): 4.5V; Voltage - Input (Max): 18V; Voltage - Output (Min/Fixed): 0.6V; Voltage - Output (Max): 16.2V; Current - Output: 4A, 2A; Frequency - Switching: 275kHz ~ 2.2MHz; Synchronous Rectifier: Yes; Application_BuildNumber: *; Supplier 1: Digi-Key; RoHS: RoHS Compliant; Category: Integrated Circuits (ICs); Stock 1: 2343; Pricing 1: 1=5.16, 10=4.633, 100=3.7961, 500=3.23152, 1000=2.72538 (USD); Packaging: Cut Tape (CT); Part Status: Active; Topology: Buck; Operating Temperature: -40°C ~ 125°C (TJ); Mounting Type: Surface Mount; Package / Case: 48-VFQFN Exposed Pad; Supplier Device Package: 48-VQFN (7x7); ComponentLink1URL: http://www.ti.com/lit/ds/symlink/tps65400.pdf; ComponentLink1Description: http://www.ti.com/lit/ds/symlink/tps65400.pdf; Supplier Part Number 1: 296-40902-1-ND

## Sheet Clock Synth.SchDoc: Clock Synthesizer
size Tabloid; ApprovedBy: NA; CompanyName: Cospan Design LLC; DrawnBy: Dave McCoy; Engineer: Dave McCoy; DocumentNumber: 6; Revision: A; SheetNumber: 6; SheetTotal: 20; Client: Public; Project: Enigma; ProjectPrettyName: Enigma
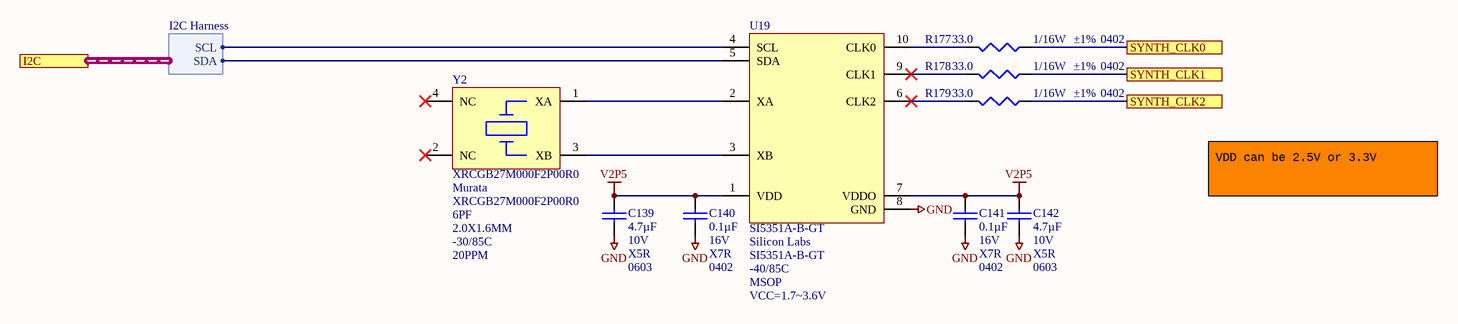
[diagram p19: Clock Synth.SchDoc]

### Parts
C139  Voltage - Rated: 10V  Temperature Coefficient: X5R  Package / Case: 0603  [C_ERA-0603]  (hidden comment: 4.7µF)
C140  Capacitance: 0.1µF  Voltage - Rated: 16V  Temperature Coefficient: X7R  Package / Case: 0402  [C_0402]  (hidden comment: 0.1uF)
C141  Capacitance: 0.1µF  Voltage - Rated: 16V  Temperature Coefficient: X7R  Package / Case: 0402  [C_0402]  (hidden comment: 0.1uF)
C142  Voltage - Rated: 10V  Temperature Coefficient: X5R  Package / Case: 0603  [C_ERA-0603]  (hidden comment: 4.7µF)
R177  Resistance In Ohms: 33.0  Power (Watts): 1/16W  Case: 0402  Tolerance: ±1%  [R_0402]  (hidden comment: R_0402_33)
R178  Resistance In Ohms: 33.0  Power (Watts): 1/16W  Case: 0402  Tolerance: ±1%  [R_0402]  (hidden comment: R_0402_33)
R179  Resistance In Ohms: 33.0  Power (Watts): 1/16W  Case: 0402  Tolerance: ±1%  [R_0402]  (hidden comment: R_0402_33)
U19  SI5351A-B-GT  Manufacturer: Silicon Labs  TEMPERATURE: -40/85C  FOOTPRINT: MSOP  VOLTS: VCC=1.7~3.6V  [SI5351]
Y2  XRCGB27M000F2P00R0  Manufacturer: Murata  CAPACITANCE: 6PF  FOOTPRINT: 2.0X1.6MM  TEMPERATURE: -30/85C  TOLERANCE: 20PPM  [XTAL_2.0X1.6MM]

### Ports
I2C (harness I2C Harness), SYNTH_CLK0, SYNTH_CLK1, SYNTH_CLK2

### Harnesses
I2C Harness: SCL, SDA

### Nets
GND: C139.1 C140.1 C141.1 C142.1 U19.8(GND)
V2P5: C139.2 C140.2 C141.2 C142.2 U19.1(VDD) U19.7(VDDO)
I2C_JC_SCL: U19.4(SCL) ; port I2C.SCL
I2C_JC_SDA: U19.5(SDA) ; port I2C.SDA
SYNTH_CLK0: R177.2 ; port SYNTH_CLK0
SYNTH_CLK1: R178.2 ; port SYNTH_CLK1
SYNTH_CLK2: R179.2 ; port SYNTH_CLK2
NetR177_1: R177.1 U19.10(CLK0)
NetR178_1: R178.1 U19.9(CLK1)
NetR179_1: R179.1 U19.6(CLK2)
NetU19_2: U19.2(XA) Y2.1(XA)
NetU19_3: U19.3(XB) Y2.3(XB)

Not connected (* = marked no-connect by the designer): Y2 2(NC)* 4(NC)*

### Notes on the sheet
- VDD can be 2.5V or 3.3V
- Project:
- http://www.cospandesign.com
- Cospan Design
- Document:
- Engineer:
- Title:
- Client:
- Approved By:
- Revision:
- Date:
- Number:
- of

### Library data of the parts
C139 C142 = C_0603_4.7uF_10V: CAP CER 4.7UF 10V X5R 0603; Manufacturer: Murata Electronics North America; Manufacturer Part Number: GRM188R61A475KE15D; Tolerance: ±10%; Supplier 1: Digi-Key; RoHS: RoHS Compliant; Category: Capacitors; Stock 1: 163304; Pricing 1: 1=0.15, 10=0.105, 100=0.0495, 500=0.03472, 1000=0.02875 (USD); Mounting Type: Surface Mount, MLCC; Operating Temperature: -55°C ~ 85°C; Features: Derating Recommended; Applications: General Purpose; Ratings: -; Size / Dimension: 0.063" L x 0.032" W (1.60mm x 0.80mm); Lead Spacing: -; Packaging: Cut Tape (CT); Lead Style: -; ComponentLink1URL: http://search.murata.co.jp/Ceramy/image/img/A01X/G101/ENG/GRM188R61A475KE15-01.pdf; ComponentLink1Description: http://search.murata.co.jp/Ceramy/image/img/A01X/G101/ENG/GRM188R61A475KE15-01.pdf; Supplier Part Number 1: 490-10477-1-ND; Capacitance: 4.7µF; Part Status: Active; Height - Seated (Max): -; Thickness (Max): 0.039" (1.00mm)
C140 C141 = C_0402_0.1UF_16V: as C17 on sheet Battery Manager; Supplier 1: Digi-Key; Supplier Part Number 1: 490-6328-1-ND; RoHS: RoHS Compliant; Category: Capacitors; Stock 1: 18103134; Mounting Type: Surface Mount, MLCC; Features: -; Lead Spacing: -; Packaging: Cut Tape (CT); ComponentLink1URL: http://www.murata.com/~/media/webrenewal/support/library/catalog/products/capacitor/mlcc/c02e.ashx?la=en-us; ComponentLink1Description: http://www.murata.com/~/media/webrenewal/support/library/catalog/products/capacitor/mlcc/c02e.ashx?la=en-us; Operating Temperature: -55°C ~ 125°C; Pricing 1: 1=0.1, 10=0.014, 100=0.0062, 500=0.00442, 1000=0.00348, 2500=0.00316, 5000=0.00291 (USD); Part Status: Active; Ratings: -; Applications: General Purpose; Size / Dimension: 0.039" L x 0.020" W (1.00mm x 0.50mm); Height - Seated (Max): -; Thickness (Max): 0.022" (0.55mm)
R177-R179 = R_0402_33: RES 33.0 OHM 1/16W 1% 0402 SMD; Manufacturer: Yageo; Manufacturer Part Number: RC0402FR-0733RL; Resistance (Ohms): 33; Temperature Coefficient: ±100ppm/°C; Supplier 1: Digi-Key; Supplier Part Number 1: 311-33.0LRCT-ND; RoHS: RoHS Compliant; Category: Resistors; Stock 1: 733920; Pricing: 10=0.014, 50=0.0104, 100=0.0079, 250=0.00584, 500=0.00432, 1000=0.00288 (USD); Composition: Thick Film; Features: -; Size / Dimension: 0.039" L x 0.020" W (1.00mm x 0.50mm); Height: 0.014" (0.35mm); Number of Terminations: 2; Packaging: Cut Tape (CT); Package / Case: 0402 (1005 Metric); ComponentLink1URL: http://www.yageo.com/documents/recent/PYu-RC0402_51_RoHS_L_6.pdf; ComponentLink1Description: http://www.yageo.com/documents/recent/PYu-RC0402_51_RoHS_L_6.pdf
U19 = U_SI5351: IC CLK GENERATOR 200MHZ 10MSOP; PLL: Yes; Input: Crystal; Output: LVCMOS; Ratio - Input:Output: 1:3; Differential - Input:Output: No/No; Divider/Multiplier: Yes/No; Voltage - Supply: 1.71 V ~ 3.6 V; Supplier 1: Digi-Key; Manufacturer Part Number: SI5351A-B-GT; RoHS: RoHS Compliant; Category: Integrated Circuits (ICs); Stock 1: 2160; Pricing 1: 1=0.92, 25=0.8816, 100=0.8475 (USD); Packaging: Cut Tape (CT); Part Status: Active; Type: Clock Generator; Frequency - Max: 200MHz; Operating Temperature: -40°C ~ 85°C; Mounting Type: Surface Mount; Package / Case: 10-TFSOP, 10-MSOP (0.118", 3.00mm Width); Supplier Device Package: 10-MSOP; ComponentLink1URL: http://www.silabs.com/documents/public/data-sheets/Si5351-B.pdf; ComponentLink1Description: http://www.silabs.com/documents/public/data-sheets/Si5351-B.pdf; Supplier Part Number 1: 336-3908-1-ND
Y2 = Y_XTAL_27MHZ_SMD: XTAL 27.00 MHZ 6PF 150OHM 20PPM 2.0X1.6MM; Frequency: 27MHz; Operating Mode: Fundamental; ESR: ESR=150OHMS; Supplier 1: Digi-Key; RoHS: RoHS Compliant; Category: Crystals and Oscillators; Stock 1: 2678; Pricing 1: 1=0.6, 10=0.5, 50=0.4484, 100=0.399, 500=0.38, 1000=0.3192 (USD); Packaging: Cut Tape (CT); Part Status: Active; Type: MHz Crystal; Frequency Stability: ±20ppm; Frequency Tolerance: ±20ppm; Load Capacitance: 6pF; ESR (Equivalent Series Resistance): 150 Ohm; Operating Temperature: -30°C ~ 85°C; Ratings: -; Mounting Type: Surface Mount; Package / Case: 4-SMD, No Lead (DFN, LCC); Size / Dimension: 0.079" L x 0.063" W (2.00mm x 1.60mm); Height: 0.028" (0.70mm); ComponentLink1URL: http://www.murata.com/~/media/webrenewal/support/library/catalog/products/timingdevice/crystalu/p79e.ashx; ComponentLink1Description: http://www.murata.com/~/media/webrenewal/support/library/catalog/products/timingdevice/crystalu/p79e.ashx; Supplier Part Number 1: 490-9765-1-ND; Manufacturer Part Number: XRCGB27M000F2P00R0